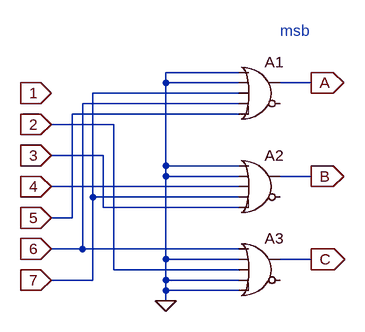
[diagram p0: schematic Draft7.asc]
Draft7.asc, the LTspice schematic file:
Version 4
SHEET 1 880 680
WIRE 240 16 128 16
WIRE 128 32 128 16
WIRE 240 32 128 32
WIRE 352 32 304 32
WIRE 240 48 16 48
WIRE 240 64 0 64
WIRE 240 80 -16 80
WIRE 48 96 -48 96
WIRE 32 144 -48 144
WIRE 128 160 128 32
WIRE 240 160 128 160
WIRE 128 176 128 160
WIRE 240 176 128 176
WIRE 352 176 304 176
WIRE 240 192 -48 192
WIRE 16 208 16 48
WIRE 240 208 16 208
WIRE 32 224 32 144
WIRE 240 224 32 224
WIRE -16 240 -16 80
WIRE -16 240 -48 240
WIRE 0 288 0 64
WIRE 0 288 -48 288
WIRE 240 288 0 288
WIRE 128 304 128 176
WIRE 240 304 128 304
WIRE 352 304 304 304
WIRE 48 320 48 96
WIRE 240 320 48 320
WIRE 16 336 16 208
WIRE 16 336 -48 336
WIRE 128 336 128 304
WIRE 240 336 128 336
WIRE 128 352 128 336
WIRE 240 352 128 352
WIRE 128 368 128 352
FLAG -48 48 1
IOPIN -48 48 In
FLAG -48 96 2
IOPIN -48 96 In
FLAG -48 144 3
IOPIN -48 144 In
FLAG -48 192 4
IOPIN -48 192 In
FLAG -48 240 5
IOPIN -48 240 In
FLAG -48 288 6
IOPIN -48 288 In
FLAG -48 336 7
IOPIN -48 336 In
FLAG 128 368 0
FLAG 352 32 A
IOPIN 352 32 Out
FLAG 352 176 B
IOPIN 352 176 Out
FLAG 352 304 C
IOPIN 352 304 Out
SYMBOL Digital\\or 272 -16 R0
SYMATTR InstName A1
SYMBOL Digital\\or 272 128 R0
SYMATTR InstName A2
SYMBOL Digital\\or 272 256 R0
SYMATTR InstName A3
TEXT 304 -48 Left 2 ;msb

The netlist it stands for:
* Draft7.asc
A1 0 0 7 6 5 0 A 0 OR
A2 0 0 4 7 3 0 B 0 OR
A3 6 0 2 0 0 0 C 0 OR
* msb
.backanno
.end